# Altium project MinusOneProject.PrjPcb
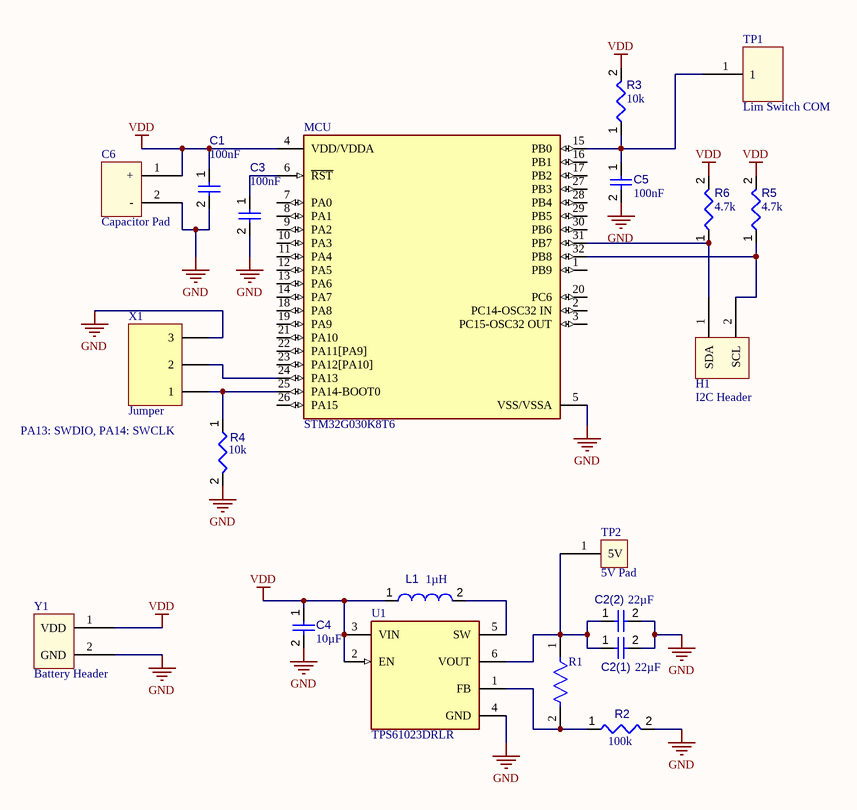
[diagram p0: Dispenser.SchDoc]
1 sheet, 21 parts. Net scope: global (net labels, ports and power ports of the same name join across sheets).
Board file: Dispenser.PcbDoc

## Sheet Dispenser.SchDoc
size A; SheetNumber: 1; SheetTotal: 1; SPICEModelCacheBJOKPNFG: <root> / <DocumentId>BJOKPNFG</DocumentId> / </root>

### Parts
C1  value 100nF  [CAPC2013X95X50LL10T25]  (hidden comment: Capacitor 100 nF +/-10% 50 V 0805)
C2(1)  value 22µF  [CAPC0805(2012)145_L]  (hidden comment: Capacitor 22µF +/-40% 16V 0805)
C2(2)  value 22µF  [CAPC0805(2012)145_L]  (hidden comment: Capacitor 22µF +/-40% 16V 0805)
C3  value 100nF  [CAPC1005X56X25LL10T15]  (hidden comment: Capacitor 0.1 uF +/- 5% 16 V 0402)
C4  value 10µF  [CAPC0603(1608)100_L]  (hidden comment: Capacitor 10µF +/-20% 10V 0603)
C5  value 100nF  [CAPC0402(1005)60_L]  (hidden comment: Capacitor 100nF +/-20% 10V 0402)
C6  Capacitor Pad  [CAP_PAD]
H1  I2C Header  [HEADER_1X02]
L1  value 1µH  [INDC2520X120X60NL20T20]  (hidden comment: LQM2HPN1R0MJ0L)
MCU  STM32G030K8T6  [FP-LQFP32-5V-IPC_A]
R1  CPF0603B732KE  [FP-CPF0603-MFG]  (value not drawn)
R2  value 100k  [RESC1608X55X25ML10T15]  (hidden comment: Resistor 100k +/-1% 0603 100 mW)
R3  value 10k  [RESC3216X60X45ML15T20]  (hidden comment: Resistor 10k +/-1% 1206 250 mW)
R4  value 10k  [RESC3216X60X45ML15T20]  (hidden comment: Resistor 10k +/-1% 1206 250 mW)
R5  value 4.7k  [RESC3116X70X50ML13T20]  (hidden comment: Resistor 4k7 +/-1% 1206 250 mW)
R6  value 4.7k  [RESC3116X70X50ML13T20]  (hidden comment: Resistor 4k7 +/-1% 1206 250 mW)
TP1  Lim Switch COM  [HEADER_1X01]
TP2  5V Pad  [PAD_5V]
U1  TPS61023DRLR  [FP-DRL0006A-MFG]
X1  Jumper  [PIN_3_JUMPER]
Y1  Battery Header  [BATTERY_HEADER]

### Nets
GND: C1.2 C2(1).2 C2(2).2 C3.2 C4.2 C5.2 C6.2(-) MCU.5(VSS/VSSA) R2.2 R4.2 U1.4(GND) X1.3 Y1.2(GND)
VDD: C1.1 C4.1 C6.1(+) L1.1 MCU.4(VDD/VDDA) R3.2 R5.2 R6.2 U1.2(EN) U1.3(VIN) Y1.1(VDD)
NetC2(1)_1: C2(1).1 C2(2).1 R1.1 TP2.1(5V) U1.6(VOUT)
NetC3_1: C3.1 MCU.6(~{RST})
NetC5_1: C5.1 MCU.15(PB0) R3.1 TP1.1
NetH1_1: H1.1(SDA) MCU.31(PB7) R6.1
NetH1_2: H1.2(SCL) MCU.32(PB8) R5.1
NetL1_2: L1.2 U1.5(SW)
NetMCU_24: MCU.24(PA13) X1.2
NetMCU_25: MCU.25(PA14-BOOT0) R4.1 X1.1
NetR1_2: R1.2 R2.1 U1.1(FB)

Not connected (* = marked no-connect by the designer): MCU 1(PB9) 2(PC14-OSC32_IN) 3(PC15-OSC32_OUT) 7(PA0) 8(PA1) 9(PA2) 10(PA3) 11(PA4) 12(PA5) 13(PA6) 14(PA7) 16(PB1) 17(PB2) 18(PA8) 19(PA9) 20(PC6) 21(PA10) 22(PA11[PA9]) 23(PA12[PA10]) 26(PA15) 27(PB3) 28(PB4) 29(PB5) 30(PB6)

### Notes on the sheet
- PA13: SWDIO, PA14: SWCLK

### Library data of the parts
C1 = CMP-001-00018-6: Chip Capacitor, 100 nF, +/- 10%, 50 V, 0805 (2012 Metric); Capacitor Type: Ceramic; Voltage Rating: 50V; Pins: 2; Max Operating Temperature: 125°C; Min Operating Temperature: -55°C; Mounting Technology: SM; Case/Package: 0805; RoHS Compliant: True; Tolerance: 10%
C2(1) C2(2) = CMP-001-00081-4: Chip Capacitor, 22µF +/-40%, 16V, 0805, Thickness 1.45 mm; Tolerance: 5%; Voltage Rating: 16V; Mounting Technology: SMT; Pins: 2; Max Operating Temperature: 85°C; Case/Package: 0805; Min Operating Temperature: -55°C
C3 = CMP-001-00001-6: Chip Capacitor, 0.1 uF, +/- 5%, 16 V, 0402 (1005 Metric); Capacitor Type: Ceramic; Voltage Rating: 16V; Max Operating Temperature: 125°C; Min Operating Temperature: -55°C; Case/Package: 0402; Mounting Technology: SM; Pins: 2; Tolerance: 5%; RoHS Compliant: True
C4 = CMP-001-00075-4: Chip Capacitor, 10µF +/-20%, 10V, 0603, Thickness 1 mm; Tolerance: 10%; Voltage Rating: 10V; Max Operating Temperature: 85°C; Pins: 2; Case/Package: 0603; Mounting Technology: SMT; Min Operating Temperature: -55°C
C5 = CMP-001-00061-3: Chip Capacitor, 100nF +/-20%, 10V, 0402, Thickness 0.6 mm; Tolerance: 20%; Mounting Technology: SMT; Voltage Rating: 10V; Max Operating Temperature: 85°C; Pins: 2; Case/Package: 0402; Min Operating Temperature: -55°C
C6 = CAP_PAD
H1 = HEADER_1X02
L1 = CMP-006-00008-6: Chip Inductor, 1 uH, +/- 20%, 1 MHz, -55 to 125 degC, 1008 (2520 Metric), RoHS, Tape and Reel; Manufacturer: Murata; Self Resonant Frequency: 70MHz; Current Rating: 1.5A; Shielding: Shielded; Core Material: Ferrite; Resistance: 0.09Ohm; Datasheet URL: http://psearch.en.murata.com/inductor/product/LQM2HPN1R0MJ0%23.pdf; Datasheet Version: Aug-16; RoHS Compliant: True; Case/Package: 1008; Package Description: 2-Pin Surface Mount Device, Body 2.5 x 2 mm; Package Quantity: 3000; Tolerance: 20%; Min Operating Temperature: -40°C; Package Reference: 1008; Packaging: TapeandReel; Mounting Technology: SM; Max Operating Temperature: 85°C
MCU = CMP-12105-000136-1: IC MCU 32BIT 64KB FLASH 32LQFP; RoHS Compliant: Yes
R1 = CMP-03211-008829-1: RES SMD 732KΩ 0.1% 1/16W 0603; Manufacturer: TE Connectivity; Power Rating: 0.063W; Voltage Rating: 50V; Temperature Coefficient: 25ppm/°C; ComponentLink2URL: https://www.te.com/commerce/DocumentDelivery/DDEController?Action=showdoc&DocId=Data+Sheet%7F1773200%7FM%7Fpdf%7FEnglish%7FENG_DS_1773200_M.pdf%7F3-1676481-2; Temperature Range Low: -55°C; Resistance: 732KΩ; Temperature: -55°C to +155°C; Automotive: No; Composition: Thin Film; Category: Res; Manufacturer Part Number: CPF0603B732KE; Ipc Land Pattern Name: RESC15580X45; Height: 0.55mm; packaging: 5k Reel; Tolerance: 0.1%; Series: CPF; Device Class L3: Chip SMD Resistors; Temperature Range High: +155°C; Package: CPF0603; ComponentLink2Description: Datasheet; Device Class L1: Passive Components; octopart_url: https://octopart.com/cpf0603b732ke-te+connectivity-80329877; Device Class L2: Resistors; Value: 732KΩ; RoHS: TRUE; Octopart: https://octopart.com/cpf0603b732ke-te+connectivity-80329877; Lead Free: Yes
R2 = CMP-009-00023-5: Chip Resistor, 100 KOhm, +/- 1%, 0.1 W, -55 to 155 degC, 0603 (1608 Metric); Voltage Rating: 50V; Power: 100mW; Max Operating Temperature: 155°C; RoHS Compliant: True; Tolerance: 1%; Pins: 2; Case/Package: 0603; Mounting Technology: SM; Min Operating Temperature: -55°C
R3 R4 = CMP-009-00016-5: Chip Resistor, 10 KOhm, +/- 1%, 0.25 W, -55 to 155 degC, 1206 (3216 Metric); Power: 250mW; Voltage Rating: 200V; Pins: 2; Max Operating Temperature: 155°C; Tolerance: 1%; RoHS Compliant: True; Case/Package: 1206; Min Operating Temperature: -55°C; Mounting Technology: SM
R5 R6 = CMP-009-00033-5: Chip Resistor, 4.7 KOhm, +/- 1%, 0.25 W, -55 to 155 degC, 1206 (3216 Metric); Power: 250mW; Voltage Rating: 200V; Pins: 2; Min Operating Temperature: -55°C; Max Operating Temperature: 155°C; Case/Package: 1206; Tolerance: 1%; RoHS Compliant: True; Mounting Technology: SM
TP1 = HEADER_1X01
TP2 = PAD_5V
U1 = CMP-04918-000638-1: FINISH GOODS FOR TPS61023
X1 = PIN_3_JUMPER
Y1 = BATTERY_HEADER